# EAGLE design shift_reg (EAGLE 9.0.0)
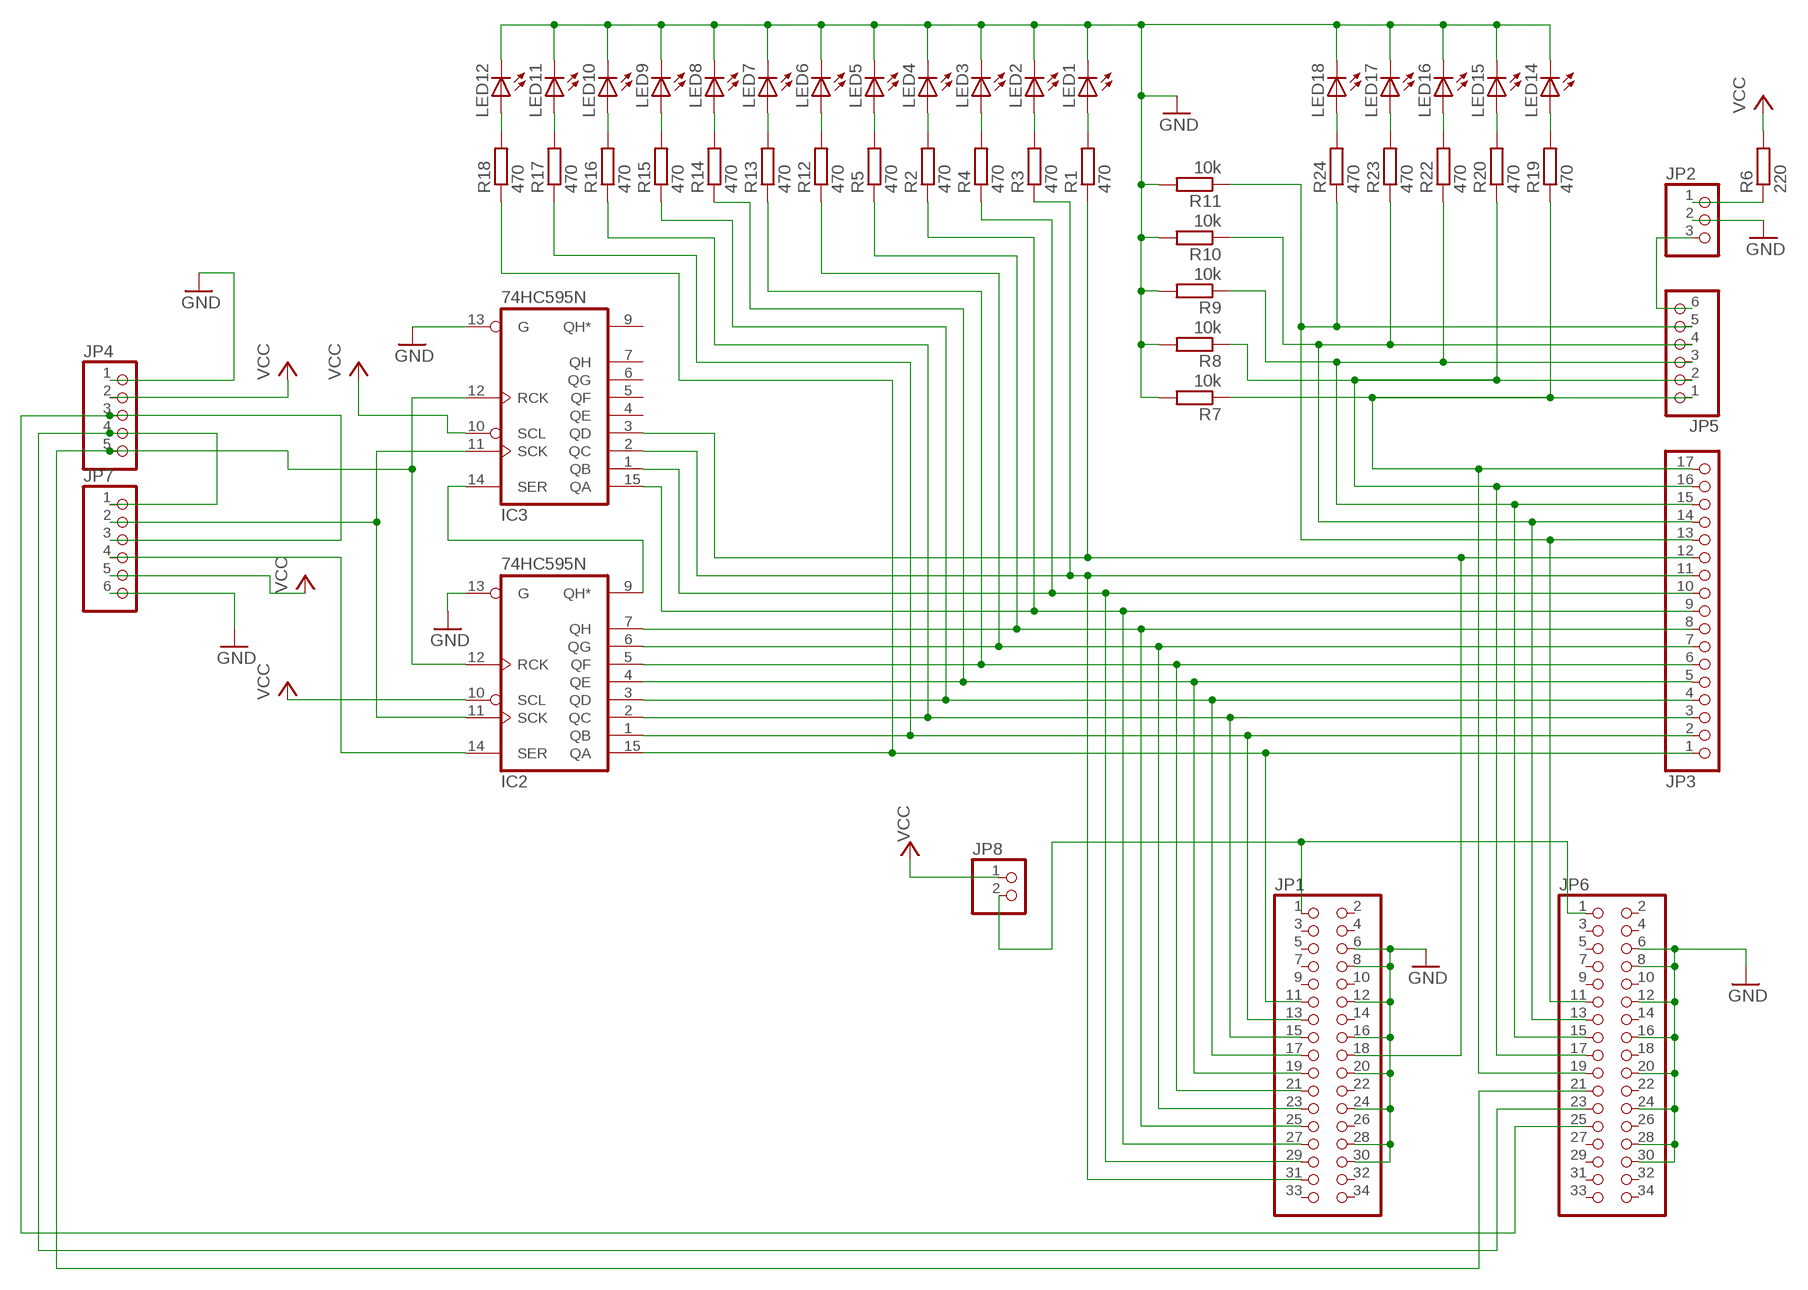
[diagram p0: schematic, sheet 1]

## Parts
IC2  74HC595N  [DIL16]
IC3  74HC595N  [DIL16]
JP1  PINHD-2X17  [2X17]
JP2  PINHD-1X3  [1X03]
JP3  PINHD-1X17  [1X17]
JP4  PINHD-1X5  [1X05]
JP5  PINHD-1X6  [1X06]
JP6  PINHD-2X17  [2X17]
JP7  PINHD-1X6  [1X06]
JP8  PINHD-1X2  [1X02]
LED1  LED3MM  [LED3MM]
LED2  LED3MM  [LED3MM]
LED3  LED3MM  [LED3MM]
LED4  LED3MM  [LED3MM]
LED5  LED3MM  [LED3MM]
LED6  LED3MM  [LED3MM]
LED7  LED3MM  [LED3MM]
LED8  LED3MM  [LED3MM]
LED9  LED3MM  [LED3MM]
LED10  LED3MM  [LED3MM]
LED11  LED3MM  [LED3MM]
LED12  LED3MM  [LED3MM]
LED14  LED3MM  [LED3MM]
LED15  LED3MM  [LED3MM]
LED16  LED3MM  [LED3MM]
LED17  LED3MM  [LED3MM]
LED18  LED3MM  [LED3MM]
R1  470  R-EU_0207/10  [0207/10]
R2  470  R-EU_0207/10  [0207/10]
R3  470  R-EU_0207/10  [0207/10]
R4  470  R-EU_0207/10  [0207/10]
R5  470  R-EU_0207/10  [0207/10]
R6  220  R-EU_0207/10  [0207/10]
R7  10k  R-EU_0207/10  [0207/10]
R8  10k  R-EU_0207/10  [0207/10]
R9  10k  R-EU_0207/10  [0207/10]
R10  10k  R-EU_0207/10  [0207/10]
R11  10k  R-EU_0207/10  [0207/10]
R12  470  R-EU_0207/10  [0207/10]
R13  470  R-EU_0207/10  [0207/10]
R14  470  R-EU_0207/10  [0207/10]
R15  470  R-EU_0207/10  [0207/10]
R16  470  R-EU_0207/10  [0207/10]
R17  470  R-EU_0207/10  [0207/10]
R18  470  R-EU_0207/10  [0207/10]
R19  470  R-EU_0207/10  [0207/10]
R20  470  R-EU_0207/10  [0207/10]
R22  470  R-EU_0207/10  [0207/10]
R23  470  R-EU_0207/10  [0207/10]
R24  470  R-EU_0207/10  [0207/10]

## Nets
GND: IC2.13(G) IC3.13(G) JP1.6 JP1.8 JP1.12 JP1.16 JP1.20 JP1.24 JP1.28 JP1.30 JP2.2 JP4.1 JP6.6 JP6.8 JP6.12 JP6.16 JP6.20 JP6.24 JP6.28 JP6.30 JP7.6 LED1.K(C) LED2.K(C) LED3.K(C) LED4.K(C) LED5.K(C) LED6.K(C) LED7.K(C) LED8.K(C) LED9.K(C) LED10.K(C) LED11.K(C) LED12.K(C) LED14.K(C) LED15.K(C) LED16.K(C) LED17.K(C) LED18.K(C) R7.2 R8.2 R9.2 R10.2 R11.2
N$1: JP3.13 JP5.5 JP6.11 R11.1 R24.1
N$2: JP2.3 JP5.6
N$3: JP3.15 JP5.3 JP6.15 R9.1 R22.1
N$4: LED1.A R1.2
N$5: JP1.1 JP6.1 JP8.2
N$7: IC2.12(RCK) IC3.12(RCK) JP4.5 JP6.21
N$8: IC2.7(QH) JP1.25 JP3.8 R5.1
N$9: IC3.15(QA) JP1.27 JP3.9 R2.1
N$12: IC2.9(QH*) IC3.14(SER)
N$13: IC2.14(SER) JP7.4
N$14: JP3.16 JP5.2 JP6.17 R8.1 R20.1
N$15: JP2.1 R6.1
N$17: IC2.5(QF) JP1.21 JP3.6 R13.1
N$18: JP3.17 JP5.1 JP6.19 R7.1 R19.1
N$19: LED2.A R3.2
N$20: LED3.A R4.2
N$21: JP3.14 JP5.4 JP6.13 R10.1 R23.1
N$22: LED4.A R2.2
N$23: LED5.A R5.2
N$27: LED9.A R15.2
N$28: LED8.A R14.2
N$29: IC3.1(QB) JP1.29 JP3.10 R4.1
N$30: IC3.2(QC) JP1.31 JP3.11 R3.1
N$31: IC3.3(QD) JP1.18 JP3.12 R1.1
N$32: LED7.A R13.2
N$33: LED6.A R12.2
N$34: LED10.A R16.2
N$35: LED11.A R17.2
N$36: LED12.A R18.2
N$37: JP4.3 JP6.25 JP7.3
N$38: JP4.4 JP6.23 JP7.1
N$39: IC2.11(SCK) IC3.11(SCK) JP7.2
N$40: IC2.1(QB) JP1.13 JP3.2 R17.1
N$42: IC2.6(QG) JP1.23 JP3.7 R12.1
N$43: IC2.15(QA) JP1.11 JP3.1 R18.1
N$44: LED14.A R19.2
N$45: LED15.A R20.2
N$46: LED16.A R22.2
N$47: LED17.A R23.2
N$48: LED18.A R24.2
N$49: IC2.2(QC) JP1.15 JP3.3 R16.1
N$50: IC2.4(QE) JP1.19 JP3.5 R14.1
N$51: IC2.3(QD) JP1.17 JP3.4 R15.1
VCC: IC2.10(SCL) IC3.10(SCL) JP4.2 JP7.5 JP8.1 R6.2
Unconnected: IC3.4(QE) IC3.5(QF) IC3.6(QG) IC3.7(QH) IC3.9(QH*) JP1.2 JP1.3 JP1.4 JP1.5 JP1.7 JP1.9 JP1.10 JP1.14 JP1.22 JP1.26 JP1.32 JP1.33 JP1.34 JP6.2 JP6.3 JP6.4 JP6.5 JP6.7 JP6.9 JP6.10 JP6.14 JP6.18 JP6.22 JP6.26 JP6.27 JP6.29 JP6.31 JP6.32 JP6.33 JP6.34

## Power pins joined to a net without a drawn wire
GND: IC2.8(GND) IC3.8(GND)
VCC: IC2.16(VCC) IC3.16(VCC)

## Library data of the parts
IC2 IC3 = 74xx-eu:74*595: 8-bit SHIFT REGISTER, output latch
JP1 JP6 = pinhead:PINHD-2X17: PIN HEADER
JP2 = pinhead:PINHD-1X3: PIN HEADER
JP3 = pinhead:PINHD-1X17: PIN HEADER
JP4 = pinhead:PINHD-1X5: PIN HEADER
JP5 JP7 = pinhead:PINHD-1X6: PIN HEADER
JP8 = pinhead:PINHD-1X2: PIN HEADER
LED1-LED12 LED14-LED18 = led:LED: LED OSRAM: - CHIPLED LG R971, LG N971, LY N971, LG Q971, LY Q971, LO R971, LY R971 LH N974, LH R974 LS Q976, LO Q976, LY Q976 LO Q996 - Hyper CHIPLED LW Q18S LB Q993, LB Q99A, LB R99A - SideLED LS A670, LO A670, LY A670, LG A670, LP A670 LB A673, LV A673, LT A673, LW A673 LH A674 LY A675 LS A676, LA A676, LO A676, LY A676, LW A676 LS A679, LY A679, LG A679 - Hyper Micro SIDELED® LS Y876, LA Y876, LO Y876, LY Y876 LT Y87S - SmartLED LW L88C, LW L88S LB L89C, LB L89S, LG L890 LS L89K, LO L89K, LY L89K LS L896, LA L896, LO L896, LY L896 - TOPLED LS T670, LO T670, LY T670, LG T670, LP T670 LSG T670, LSP T670, LSY T670, LOP T670, LYG T670 LG T671, LOG T671, LSG T671 LB T673, LV T673, LT T673, LW T673 LH T674 LS T676, LA T676, LO T676, LY T676, LB T676, LH T676, LSB T676, LW T676 LB T67C, LV T67C, LT T67C, LS T67K, LO T67K, LY T67K, LW E67C LS E67B, LA E67B, LO E67B, LY E67B, LB E67C, LV E67C, LT E67C LW T67C LS T679, LY T679, LG T679 LS T770, LO T770, LY T770, LG T770, LP T770 LB T773, LV T773, LT T773, LW T773 LH T774 LS E675, LA E675, LY E675, LS T675 LS T776, LA T776, LO T776, LY T776, LB T776 LHGB T686 LT T68C, LB T68C - Hyper Mini TOPLED® LB M676 - Mini TOPLED Santana® LG M470 LS M47K, LO M47K, LY M47K Source: http://www.osram.convergy.de LUXEON: - LUMILED® LXK2-PW12-R00, LXK2-PW12-S00, LXK2-PW14-U00, LXK2-PW14-V00 LXK2-PM12-R00, LXK2-PM12-S00, LXK2-PM14-U00 LXK2-PE12-Q00, LXK2-PE12-R00, LXK2-PE12-S00, LXK2-PE14-T00, LXK2-PE14-U00 LXK2-PB12-K00, LXK2-PB12-L00, LXK2-PB12-M00, LXK2-PB14-N00, LXK2-PB14-P00, LXK2-PB14-Q00 LXK2-PR12-L00, LXK2-PR12-M00, LXK2-PR14-Q00, LXK2-PR14-R00 LXK2-PD12-Q00, LXK2-PD12-R00, LXK2-PD12-S00 LXK2-PH12-R00, LXK2-PH12-S00 LXK2-PL12-P00, LXK2-PL12-Q00, LXK2-PL12-R00 Source: www.luxeon.com KINGBRIGHT: KA-3528ASYC Source: www.kingbright.com
R1-R20 R22-R24 = resistor:R-EU_: RESISTOR, European symbol

## Board
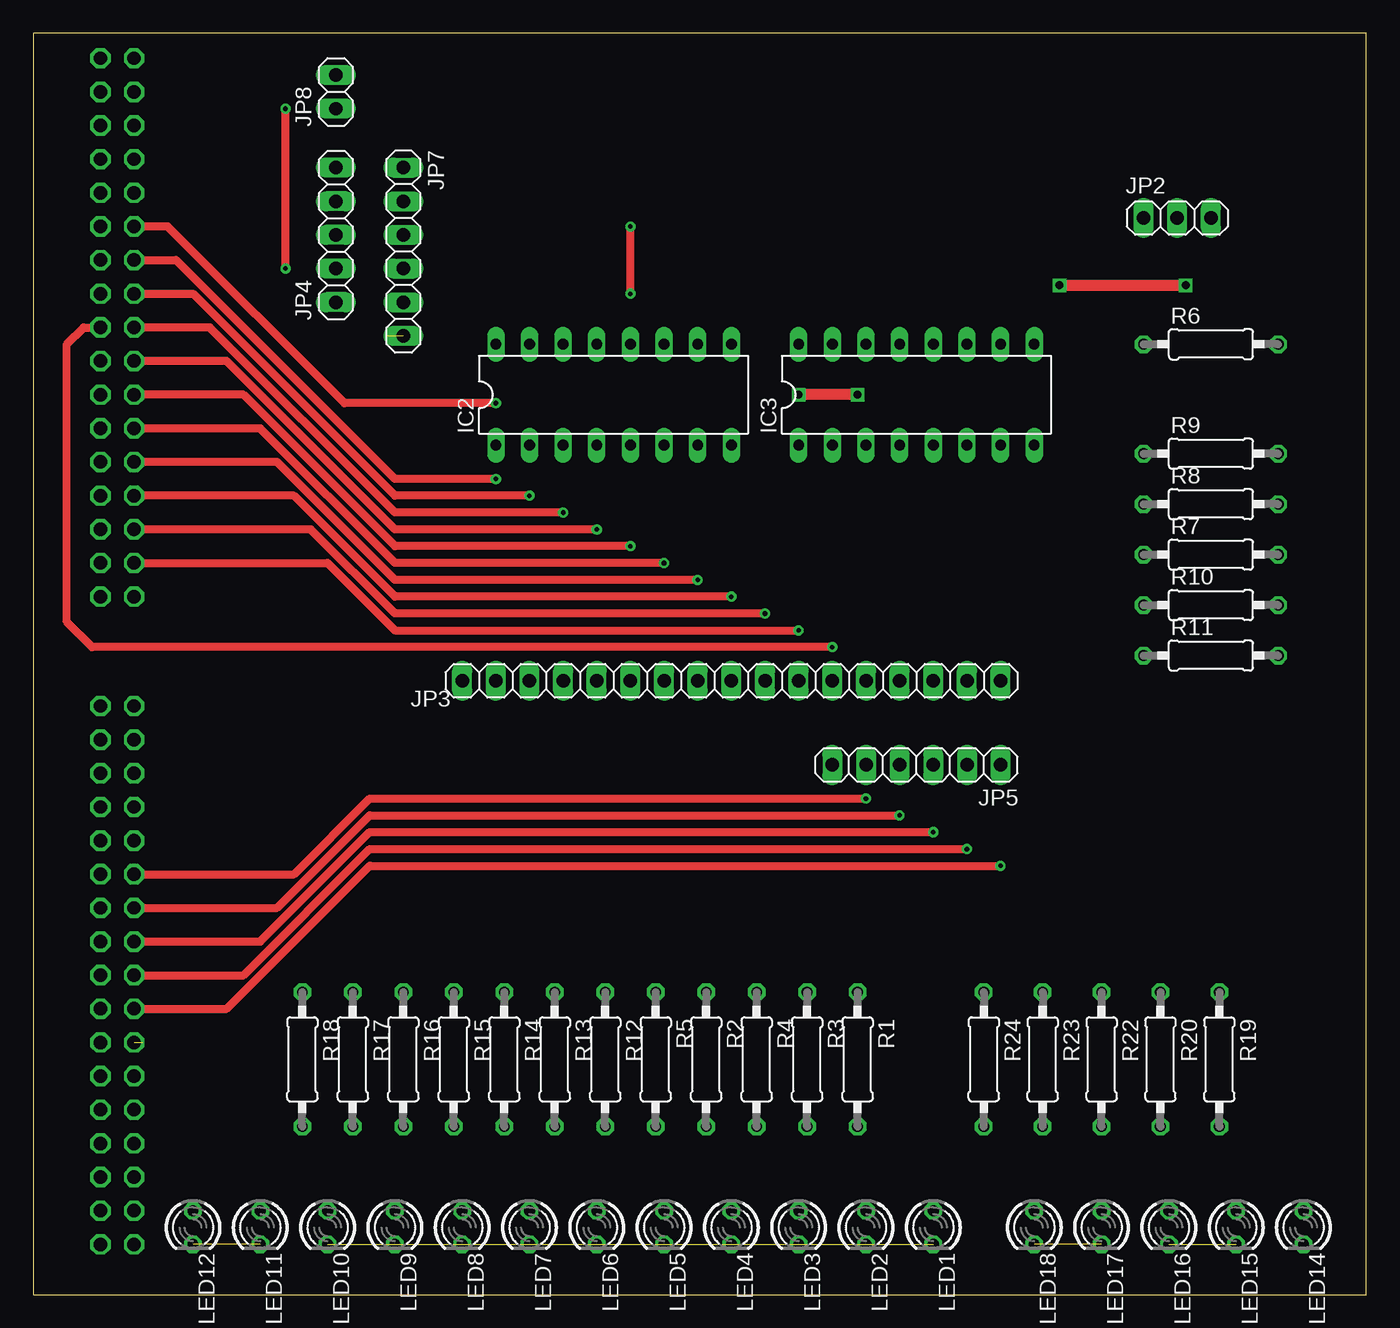
[diagram p1: board, top side]
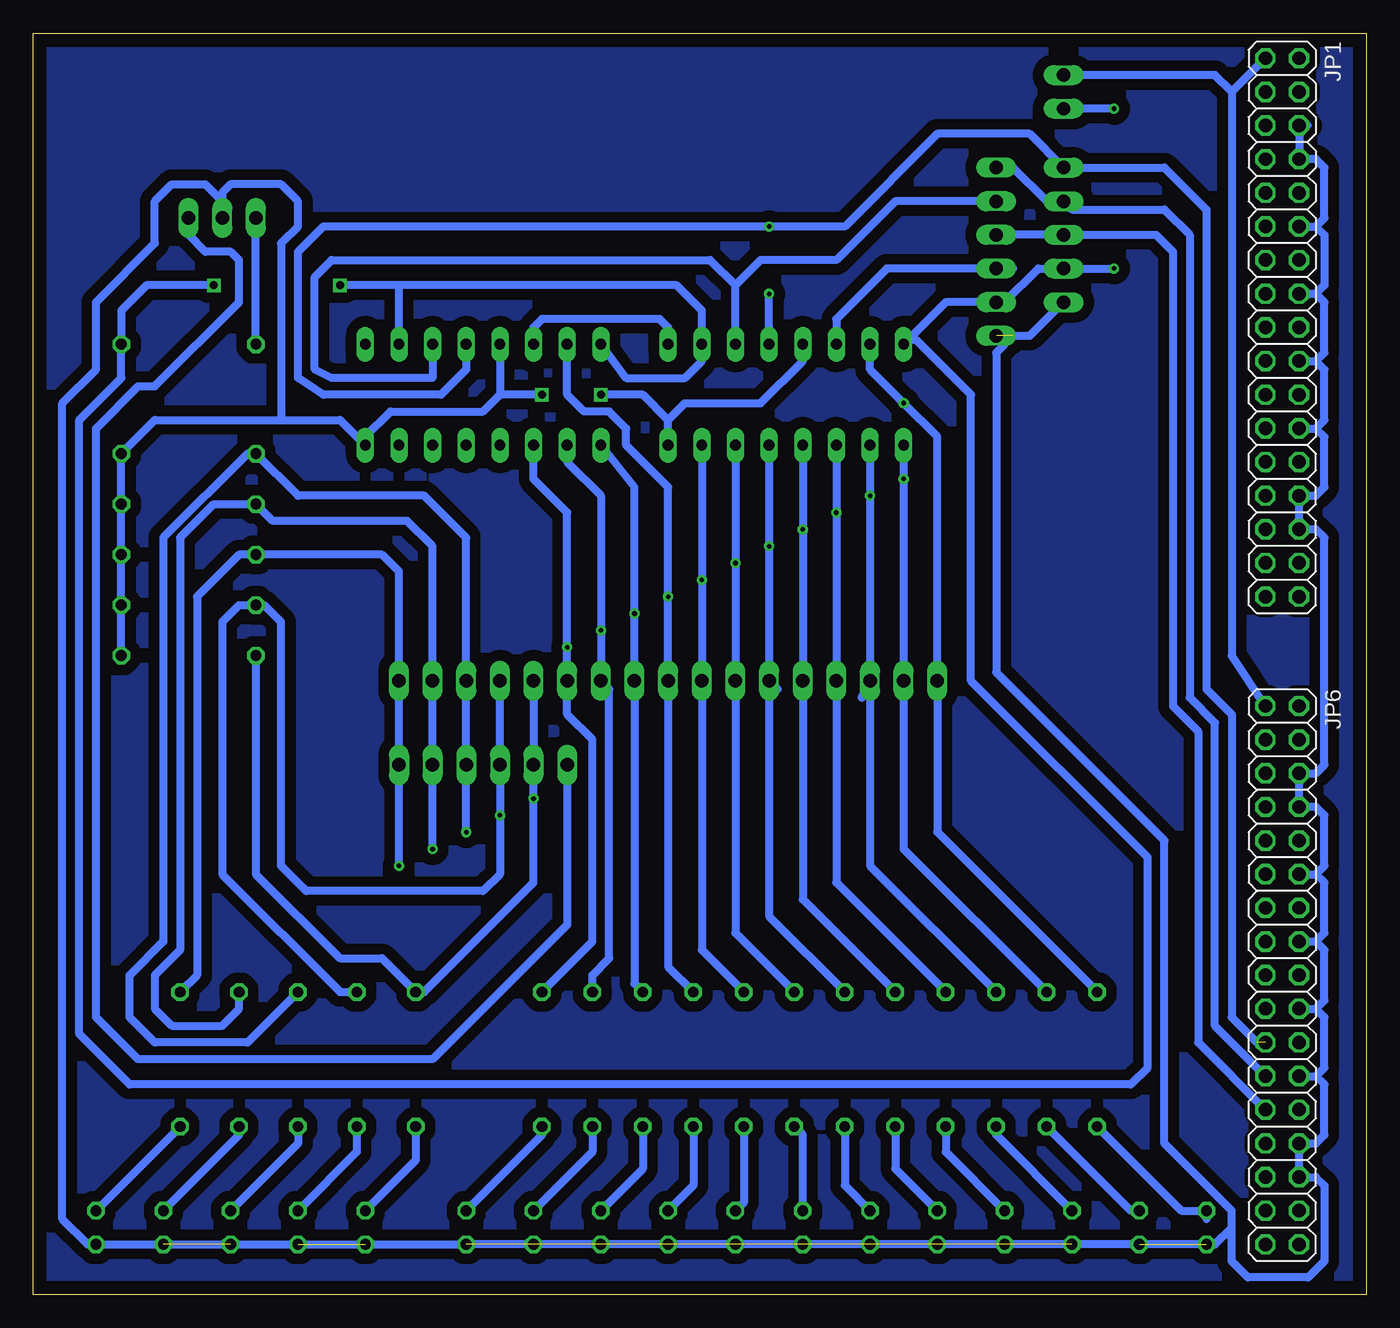
[diagram p2: board, bottom side, seen from below]

Size 100.64 x 95.24 mm. Coordinates in mm from the lower left corner, seen from the top.
Outline: 0,0 100.64,0 100.64,95.24 0,95.24 0,0
Copper layers (1*16): Top 0.035mm / dielectric 1.5mm / Bottom 0.035mm
Design rules "default": minimum track width 10mil, minimum drill 24mil, track to track 8mil, track to pad 8mil, pad to pad 8mil, via to via 8mil, smd to smd 8mil, copper to edge 40mil, drill to drill 8mil, minimum pad ring 10mil, minimum via ring 8mil, stop-mask expansion 4mil, vias tented up to drill 0mil, thermal gap 10mil

### Footprints (pad centres in the part's own frame; a part is rotated, then mirrored left to right if it is on the bottom)
DIL16 = drill 0.813 long: 1 -8.89,-3.81; 2 -6.35,-3.81; 3 -3.81,-3.81; 4 -1.27,-3.81; 5 1.27,-3.81; 6 3.81,-3.81; 7 6.35,-3.81; 8 8.89,-3.81; 9 8.89,3.81; 10 6.35,3.81; 11 3.81,3.81; 12 1.27,3.81; 13 -1.27,3.81; 14 -3.81,3.81; 15 -6.35,3.81; 16 -8.89,3.81
2X17 = drill 1.016 octagon: 1 -20.32,-1.27; 2 -20.32,1.27; 3 -17.78,-1.27; 4 -17.78,1.27; 5 -15.24,-1.27; 6 -15.24,1.27; 7 -12.7,-1.27; 8 -12.7,1.27; 9 -10.16,-1.27; 10 -10.16,1.27; 11 -7.62,-1.27; 12 -7.62,1.27; 13 -5.08,-1.27; 14 -5.08,1.27; 15 -2.54,-1.27; 16 -2.54,1.27; 17 0,-1.27; 18 0,1.27; 19 2.54,-1.27; 20 2.54,1.27; 21 5.08,-1.27; 22 5.08,1.27; 23 7.62,-1.27; 24 7.62,1.27; 25 10.16,-1.27; 26 10.16,1.27; 27 12.7,-1.27; 28 12.7,1.27; 29 15.24,-1.27; 30 15.24,1.27; 31 17.78,-1.27; 32 17.78,1.27; 33 20.32,-1.27; 34 20.32,1.27
1X03 = drill 1.016 long: 1 -2.54,0; 2 0,0; 3 2.54,0
1X17 = drill 1.016 long: 1 -20.32,0; 2 -17.78,0; 3 -15.24,0; 4 -12.7,0; 5 -10.16,0; 6 -7.62,0; 7 -5.08,0; 8 -2.54,0; 9 0,0; 10 2.54,0; 11 5.08,0; 12 7.62,0; 13 10.16,0; 14 12.7,0; 15 15.24,0; 16 17.78,0; 17 20.32,0
1X05 = drill 1.016 long: 1 -5.08,0; 2 -2.54,0; 3 0,0; 4 2.54,0; 5 5.08,0
1X06 = drill 1.016 long: 1 -6.35,0; 2 -3.81,0; 3 -1.27,0; 4 1.27,0; 5 3.81,0; 6 6.35,0
1X02 = drill 1.016 long: 1 -1.27,0; 2 1.27,0
LED3MM = drill 0.813 octagon: A -1.27,0; K 1.27,0
0207/10 = drill 0.813 octagon: 1 -5.08,0; 2 5.08,0

### Placement (x,y rotation side)
IC2  43.81,67.94 0 top
IC3  66.67,67.94 0 top
JP1  6.35,73.03 270 bottom
JP2  86.36,81.28 0 top
JP3  52.7,46.35 0 top
JP4  22.86,80.01 90 top
JP5  66.67,40.01 180 top
JP6  6.35,24.13 270 bottom
JP7  27.94,78.74 270 top
JP8  22.86,90.81 90 top
LED1  67.94,5.08 270 top
LED2  62.86,5.08 270 top
LED3  57.78,5.08 270 top
LED4  52.7,5.08 270 top
LED5  47.62,5.08 270 top
LED6  42.55,5.08 270 top
LED7  37.46,5.08 270 top
LED8  32.38,5.08 270 top
LED9  27.3,5.08 270 top
LED10  22.23,5.08 270 top
LED11  17.14,5.08 270 top
LED12  12.06,5.08 270 top
LED14  95.89,5.08 270 top
LED15  90.8,5.08 270 top
LED16  85.72,5.08 270 top
LED17  80.64,5.08 270 top
LED18  75.56,5.08 270 top
R1  62.23,17.78 270 top
R2  50.8,17.78 270 top
R3  58.42,17.78 270 top
R4  54.61,17.78 270 top
R5  46.99,17.78 270 top
R6  88.9,71.75 0 top
R7  88.9,55.88 0 top
R8  88.9,59.69 0 top
R9  88.9,63.5 0 top
R10  88.9,52.07 0 top
R11  88.9,48.26 0 top
R12  43.18,17.78 270 top
R13  39.37,17.78 270 top
R14  35.56,17.78 270 top
R15  31.75,17.78 270 top
R16  27.94,17.78 270 top
R17  24.13,17.78 270 top
R18  20.32,17.78 270 top
R19  89.53,17.78 270 top
R20  85.09,17.78 270 top
R22  80.64,17.78 270 top
R23  76.2,17.78 270 top
R24  71.75,17.78 270 top

### Tracks (layer width: path | path; a pad name or v marks a point on that pad's centre or on a via)
GND  (via drill 0.6)  (13 unrouted)
  Top 0.813: v62.23,67.94 v57.78,67.94
  Bottom 0.61: R11.2 R10.2 R7.2 R8.2 R9.2 91.44,66.04 81.91,66.04 | IC3.13 65.41,67.94 | 81.91,66.04 77.47,66.04 IC3.8 75.56,64.77 73.66,66.67 66.67,66.67 65.41,67.94 | 26.67,72.39 27.94,71.12 27.94,46.99 15.24,34.29 15.24,11.43 10.16,6.35 10.16,5.08 | IC2.8 52.7,66.04 | 52.7,66.04 51.44,67.31 45.72,67.31 42.55,70.48 IC2.13 | 52.7,66.04 54.61,67.94 v57.78,67.94 | v62.23,67.94 65.41,67.94 | 86.36,82.55 86.36,83.19 85.72,83.82 81.91,83.82 80.64,82.55 80.64,80.65 81.91,79.38 81.91,66.04 | 86.36,82.55 JP2.2 | 86.36,82.55 87.63,83.82 90.17,83.82 91.44,82.55 91.44,79.38 95.89,74.93 95.89,69.85 98.42,67.31 98.42,5.71 96.52,3.81 LED14.K LED15.K LED18.K LED1.K LED12.K 11.43,3.81 10.16,5.08 | JP7.6 25.4,72.39 JP4.1 | 10.16,5.08 10.16,2.54 8.94,1.32 4.39,1.32 3.17,2.54 3.17,8.26 3.81,8.89 JP6.30 JP6.28 3.81,11.43 3.17,12.07 3.17,15.88 3.81,16.51 | JP6.24 3.81,16.51 | 3.81,16.51 3.17,17.14 3.17,20.95 3.81,21.59 | JP6.20 3.81,21.59 | 3.81,21.59 3.17,22.23 3.17,26.04 3.81,26.67 | JP6.16 3.81,26.67 | 3.81,26.67 3.17,27.3 3.17,31.12 3.81,31.75 | JP6.12 3.81,31.75 | 3.81,31.75 3.17,32.38 3.17,36.2 3.81,36.83 JP6.8 JP6.6 3.81,39.37 3.17,40.01 3.17,57.15 3.81,57.78 JP1.30 JP1.28 3.81,60.33 3.17,60.96 3.17,64.77 3.81,65.41 | JP1.24 3.81,65.41 | 3.81,65.41 3.17,66.04 3.17,69.85 3.81,70.48 | JP1.20 3.81,70.48 | 3.81,70.48 3.17,71.12 3.17,74.93 3.81,75.56 | JP1.16 3.81,75.56 | 3.81,75.56 3.17,76.2 3.17,80.01 3.81,80.65 | JP1.12 3.81,80.65 | 3.81,80.65 3.17,81.28 3.17,85.09 3.81,85.72 JP1.8 JP1.6 4.45,88.27
N$1  (via drill 0.35)
  Top 0.61: v62.86,37.47 25.4,37.47 19.69,31.75 JP6.11
  Bottom 0.61: JP3.13 JP5.5 v62.86,37.47 62.86,31.12 71.12,22.86 R24.1 74.3,25.4 77.47,25.4 83.82,31.75 R11.1
N$2
  Bottom 0.61: JP2.3 88.9,80.01 87.63,78.74 85.72,78.74 85.09,78.1 85.09,74.93 91.44,68.58 92.71,68.58 95.89,65.41 95.89,20.95 92.71,17.78 70.48,17.78 60.33,27.94 JP5.6
N$3  (via drill 0.35)
  Top 0.61: JP6.15 17.14,26.67 25.4,34.92 v67.94,34.92
  Bottom 0.61: JP3.15 JP5.3 v67.94,34.92 | JP3.15 67.94,47.62 | JP3.15 67.94,57.15 71.12,60.33 80.64,60.33 R9.1 84.45,63.5 90.8,57.15 90.8,26.67 93.34,24.13 93.34,20.95 91.44,19.05 84.45,19.05 R22.1
N$4
  Bottom 0.61: R1.2 62.23,12.07 LED1.A
N$5
  Bottom 0.61: JP6.1 10.16,48.26 10.16,90.81 | JP1.1 10.16,90.81 | 10.16,90.81 11.43,92.08 JP8.2
N$7  (via drill 0.35)  (1 unrouted)
  Top 0.61: v45.09,75.56 v45.09,80.65
  Bottom 0.61: IC3.12 67.94,69.85 69.85,67.94 78.74,67.94 80.64,69.22 80.64,78.74 78.74,80.65 v45.09,80.65 | 45.09,73.03 IC2.12 v45.09,75.56 | v45.09,80.65 45.72,80.65 | v45.09,80.65 39.37,80.65 32.38,87.63 25.4,87.63 JP4.5 15.24,85.09 12.06,81.91 12.06,45.72 10.16,43.81 10.16,20.95 8.25,19.05
N$8  (via drill 0.35)
  Top 0.61: v50.16,53.98 27.3,53.98 18.41,62.86 JP1.25
  Bottom 0.61: IC2.7 v50.16,53.98 JP3.8 50.16,26.04 R5.1
N$9  (via drill 0.35)
  Top 0.61: v52.7,52.7 27.3,52.7 19.69,60.33 JP1.27
  Bottom 0.61: IC3.15 60.33,67.94 59.05,66.67 57.15,66.67 55.88,65.41 55.88,64.13 52.7,60.96 v52.7,52.7 JP3.9 52.7,24.77 R2.1
N$12
  Bottom 0.61: IC2.9 52.7,73.03 53.34,73.66 62.23,73.66 62.86,73.03 IC3.14
N$13
  Bottom 0.61: IC2.14 40,73.66 36.2,77.47 JP7.4 26.67,77.47
N$14  (via drill 0.35)
  Top 0.61: JP6.17 15.88,24.13 25.4,33.66 v70.48,33.66
  Bottom 0.61: v70.48,33.66 JP5.2 JP3.16 70.48,56.52 72.39,58.42 82.55,58.42 R8.1 87,59.69 89.53,57.15 89.53,26.04 91.44,24.13 91.44,21.59 90.17,20.32 86.36,20.32 85.09,21.59 R20.1
N$15
  Bottom 0.61: R6.1 JP2.1
N$17  (via drill 0.35)
  Top 0.61: JP1.21 15.88,67.94 27.3,56.52 v45.09,56.52
  Bottom 0.61: IC2.5 v45.09,56.52 JP3.6 | 44.45,45.72 JP3.6 | JP3.6 45.09,28.57 R13.1
N$18  (via drill 0.35)
  Top 0.61: JP6.19 14.6,21.59 25.4,32.38 v73.03,32.38
  Bottom 0.61: v73.03,32.38 JP5.1 JP3.17 73.03,54.61 74.3,55.88 R7.1 85.09,55.88 88.27,52.7 88.27,24.13 R19.1
N$19
  Bottom 0.61: R3.2 58.42,10.8 LED2.A
N$20
  Bottom 0.61: R4.2 54.61,9.52 LED3.A
N$21  (via drill 0.35)
  Top 0.61: JP6.13 18.41,29.21 25.4,36.2 v65.41,36.2
  Bottom 0.61: JP3.14 JP5.4 v65.41,36.2 65.41,31.75 66.67,30.48 80.01,30.48 81.91,32.38 81.91,50.8 83.19,52.07 R10.1 85.09,52.07 86.36,50.8 86.36,31.75 77.47,22.86 R23.1
N$22
  Bottom 0.61: R2.2 50.8,8.26 LED4.A
N$23
  Bottom 0.61: R5.2 46.99,6.98 LED5.A
N$24
  pour Bottom (isolate 0.813): 0,95.25 100.97,95.88 100.97,0 0,-0.63
N$27
  Bottom 0.61: R15.2 31.75,10.8 LED9.A
N$28
  Bottom 0.61: R14.2 35.56,9.52 LED8.A
N$29  (via drill 0.35)
  Top 0.61: v55.25,51.44 27.3,51.44 20.95,57.78 JP1.29
  Bottom 0.61: IC3.1 55.25,60.96 v55.25,51.44 JP3.10 55.25,23.5 R4.1
N$30  (via drill 0.35)
  Top 0.61: v57.78,50.16 27.3,50.16 22.23,55.24 JP1.31
  Bottom 0.61: IC3.2 60.33,62.86 57.78,60.33 v57.78,50.16 JP3.11 57.15,45.72 57.15,25.4 58.42,24.13 R3.1
N$31  (via drill 0.35)
  Top 0.61: JP1.18 3.81,73.03 2.54,71.75 2.54,50.8 4.45,48.89 v60.33,48.89
  Bottom 0.61: IC3.3 62.86,61.59 60.33,59.05 v60.33,48.89 JP3.12 60.33,43.81 58.42,41.91 58.42,26.67 R1.1
N$32
  Bottom 0.61: R13.2 39.37,8.26 LED7.A
N$33
  Bottom 0.61: LED6.A 42.55,12.07 R12.2
N$34
  Bottom 0.61: R16.2 27.94,12.07 LED10.A
N$35
  Bottom 0.61: R17.2 17.78,6.35 LED11.A
N$36
  Bottom 0.61: 12.06,5.71 LED12.A 13.97,6.35 R18.2
N$37
  Bottom 0.61: JP7.3 JP4.3 15.88,80.01 14.6,78.74 14.6,44.45 12.7,42.55 12.7,19.05 JP6.25
N$38
  Bottom 0.61: JP7.1 26.67,85.09 24.13,82.55 JP4.4 22.23,81.91 15.24,81.91 13.33,80.01 13.33,45.09 11.43,43.18 11.43,20.32 JP6.23
N$39
  Bottom 0.61: IC3.11 70.48,69.22 78.11,69.22 79.38,69.85 79.38,76.84 78.11,78.1 49.53,78.1 47.62,76.2 | 47.62,76.2 45.72,78.1 40,78.1 35.56,82.55 JP7.2 | IC2.11 47.62,76.2
N$40  (via drill 0.35)
  Top 0.61: v34.92,61.59 27.3,61.59 10.79,78.1 JP1.13
  Bottom 0.61: IC2.1 v34.92,61.59 JP3.2 | 34.92,45.09 JP3.2 | JP3.2 34.92,33.66 R17.1
N$42  (via drill 0.35)
  Top 0.61: JP1.23 17.14,65.41 27.3,55.24 v47.62,55.24
  Bottom 0.61: IC2.6 v47.62,55.24 JP3.7 47.62,27.3 R12.1
N$43  (via drill 0.35)
  Top 0.61: v34.92,67.31 23.49,67.31 10.16,80.65 JP1.11
  Bottom 0.61: IC2.15 37.46,69.85 v34.92,67.31 32.38,64.77 JP3.1 32.38,34.92 R18.1
N$44
  Bottom 0.61: R19.2 LED14.A
N$45
  Bottom 0.61: R20.2 85.09,12.07 LED15.A
N$46
  Bottom 0.61: R22.2 80.64,11.43 LED16.A
N$47
  Bottom 0.61: 76.2,12.07 R23.2 76.2,10.8 LED17.A
N$48
  Bottom 0.61: 71.75,12.07 R24.2 71.75,10.16 LED18.A
N$49  (via drill 0.35)
  Top 0.61: JP1.15 12.06,75.56 27.3,60.33 v37.46,60.33
  Bottom 0.61: IC2.2 v37.46,60.33 37.46,45.72 38.1,45.09 JP3.3 37.46,32.38 R16.1
N$50  (via drill 0.35)
  Top 0.61: JP1.19 14.6,70.48 27.3,57.78 v42.55,57.78
  Bottom 0.61: IC2.4 v42.55,57.78 JP3.5 42.55,29.84 R14.1
N$51  (via drill 0.35)
  Top 0.61: JP1.17 13.33,73.03 27.3,59.05 v40,59.05
  Bottom 0.61: IC2.3 v40,59.05 JP3.4 40,31.12 R15.1
VCC  (via drill 0.35, 0.6)
  Top 0.61: v19.05,77.47 v19.05,89.53
  Top 0.813: v77.47,76.2 v87,76.2
  Bottom 0.61: v87,76.2 92.08,76.2 93.98,74.3 R6.2 93.98,69.22 97.16,66.04 97.16,19.68 93.34,15.88 17.78,15.88 16.51,17.14 16.51,33.02 29.84,46.35 29.84,67.94 33.97,72.07 34.61,72.07 | 73.03,76.2 52.07,76.2 50.16,74.3 IC2.10 50.16,70.48 51.44,69.22 55.88,69.22 IC3.16 | 73.03,76.2 v77.47,76.2 | IC3.10 73.03,76.2 | 34.61,72.07 31.75,74.93 JP7.5 27.3,74.93 24.77,77.47 JP4.2 v19.05,77.47 | 34.61,72.07 IC2.16 | v19.05,89.53 JP8.1